# Altium project scratch_sandbox.PrjPcb
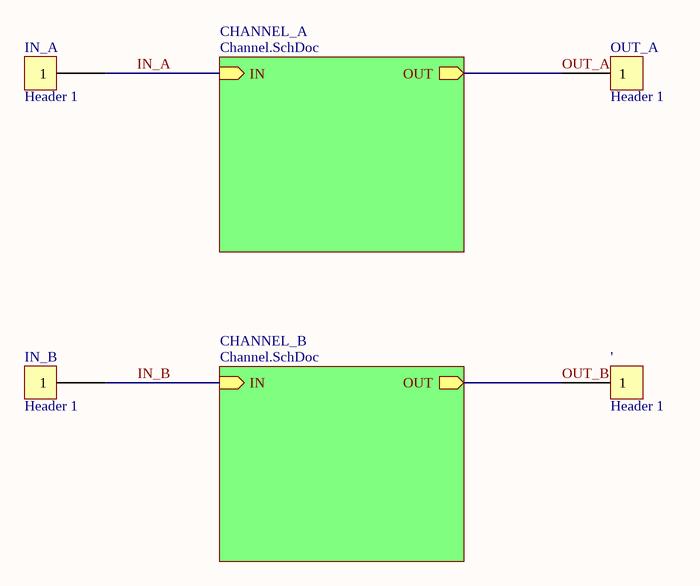
[diagram p0: MultiChannel.SchDoc]
2 sheets, 8 parts. Net scope: hierarchical (ports join the sheet entries above them; power ports are global).
Sheets:
  MultiChannel.SchDoc
    CHANNEL_A = Channel.SchDoc
    CHANNEL_B = Channel.SchDoc

## Sheet MultiChannel.SchDoc
size A4; SheetNumber: 1; SheetTotal: 2

### Parts
'  Header 1  [Header1]
IN_A  Header 1  [Header1]
IN_B  Header 1  [Header1]
OUT_A  Header 1  [Header1]

### Sub-sheets
CHANNEL_A = Channel.SchDoc: OUT (out), IN (in)
CHANNEL_B = Channel.SchDoc: OUT (out), IN (in)

### Nets
IN_A: IN_A.1 ; sheet CHANNEL_A/IN  [project net IN]
IN_B: IN_B.1 ; sheet CHANNEL_B/IN  [project net IN]
OUT_A: OUT_A.1 ; sheet CHANNEL_A/OUT  [project net OUT]
OUT_B: '.1 ; sheet CHANNEL_B/OUT  [project net OUT]

## Sheet Channel.SchDoc
size A4; SheetNumber: 2; SheetTotal: 2
Used 2 times, as channels CHANNEL_A, CHANNEL_B. Parts and nets are listed once, with the designators drawn on the sheet.
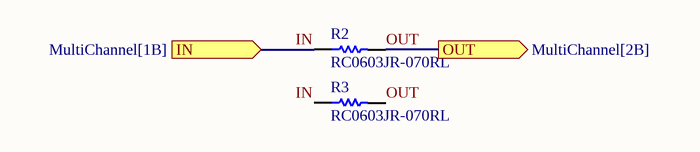
[diagram p1: Channel.SchDoc]

### Parts
R2  RC0603JR-070RL  [RESC1608X55X25ML10T15]
R3  RC0603JR-070RL  [RESC1608X55X25ML10T15]

### Ports
IN (in, see MultiChannel[1B]), OUT (out, see MultiChannel[2B])

### Nets
IN: R2.1 R3.1 ; port IN
OUT: R2.2 R3.2 ; port OUT

### Channels
CHANNEL_A: designators end in _CHANNEL_A; ports IN=IN OUT=OUT
CHANNEL_B: designators end in _CHANNEL_B; ports IN=IN OUT=OUT

### Library data of the parts
R2 R3 = CMP-2100-03667-1: Chip Resistor, 0 Ohm, +/- 5%, 0.1 W, -55 to 155 degC, 0603 (1608 Metric), RoHS, Tape and Reel; Manufacturer: Yageo; Temperature Coefficient: 200ppm/degreesC; Voltage Rating: 50V; Power Rating: 100mW; Resistance: 0mOhm; Width: 0.8mm; Max Operating Temperature: 155degC; Tolerance: 5%; Package Reference: 0603; Height: 0.45mm; Depth: 0.8mm; Package Description: 2-Pin Surface Mount Device, Body 1.6 x 0.8 mm; Termination: SMD/SMT; Package Quantity: 5000; Case/Package: 0603; Case Code (Imperial): 0603; Radiation Hardening: No; Number of Pins: 2; Length: 1.6mm; Lead Free: LeadFree; Voltage Rating (DC): 50V; Military Standard: Not; Datasheet URL: http://www.yageo.com/NewPortal/yageodocoutput?fileName=/pdf/R-Chip/PYu-RC_Group_51_RoHS_L_5.pdf; Manufacturer URL: http://www.yageo.com/; Packaging: TapeandReel; Case Code (Metric): 1608; Min Operating Temperature: -55degC; Composition: ThickFilm; RoHSCompliant: true; Contact Plating: Tin; Datasheet Version: Rev. 5, 10/2016; REACH SVHC: NoSVHC

## Nets that join several sheets
IN: MultiChannel (IN_A.1), CHANNEL_A (R2_CHANNEL_A.1 R3_CHANNEL_A.1)
IN: MultiChannel (IN_B.1), CHANNEL_B (R2_CHANNEL_B.1 R3_CHANNEL_B.1)
OUT: MultiChannel (OUT_A.1), CHANNEL_A (R2_CHANNEL_A.2 R3_CHANNEL_A.2)
OUT: MultiChannel ('.1), CHANNEL_B (R2_CHANNEL_B.2 R3_CHANNEL_B.2)